# Altium schematic sheet KB396-3P.schdoc
size 49 x 35 mm
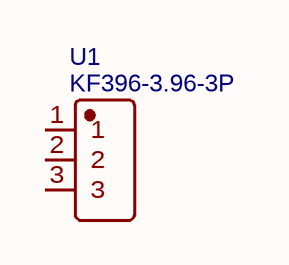
[diagram p0: KB396-3P.schdoc]

## Parts
U1  KF396-3.96-3P  [CONN-TH_3P-P3.96_KF396-3.96-3P]

## Nets

Not connected (* = marked no-connect by the designer): U1 1 2 3

## Library data of the parts
U1 = KF396-3.96-3P: BOM_Manufacturer: Cixi Kefa Elec; Contributor: LCSC; BOM_Supplier: LCSC; BOM_Supplier Part: C474895; BOM_Manufacturer Part: KF396-3.96-3P; spicePre: U; spiceSymbolName: KF396-3.96-3P